# EAGLE design DenScript 5x5 Prototyping Board V1.0 (EAGLE 9.3.0)
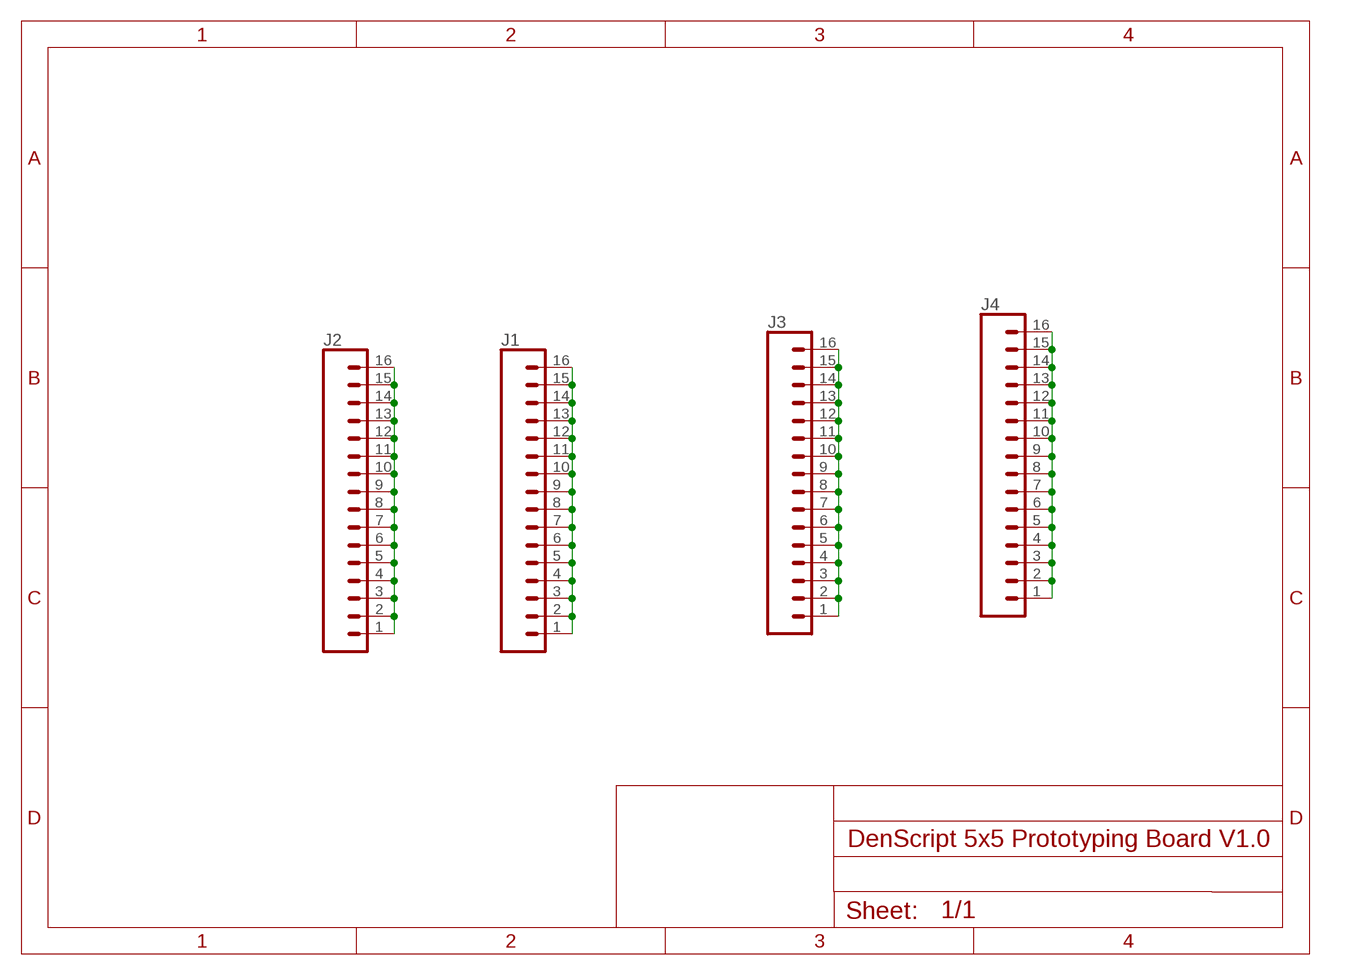
[diagram p0: schematic, sheet 1]

## Parts
J1  CONN_16  [1X16]
J2  CONN_16  [1X16]
J3  CONN_16  [1X16]
J4  CONN_16  [1X16]

## Nets
N$305: J2.1 J2.2 J2.3 J2.4 J2.5 J2.6 J2.7 J2.8 J2.9 J2.10 J2.11 J2.12 J2.13 J2.14 J2.15 J2.16
N$307: J3.1 J3.2 J3.3 J3.4 J3.5 J3.6 J3.7 J3.8 J3.9 J3.10 J3.11 J3.12 J3.13 J3.14 J3.15 J3.16
N$309: J1.1 J1.2 J1.3 J1.4 J1.5 J1.6 J1.7 J1.8 J1.9 J1.10 J1.11 J1.12 J1.13 J1.14 J1.15 J1.16
N$311: J4.1 J4.2 J4.3 J4.4 J4.5 J4.6 J4.7 J4.8 J4.9 J4.10 J4.11 J4.12 J4.13 J4.14 J4.15 J4.16

## Library data of the parts
J1-J4 = SparkFun-Connectors:CONN_16: Multi connection point. Often used as Generic Header-pin footprint for 0.1 inch spaced/style header connections On any of the 0.1 inch spaced packages, you can populate with these: Break Away Headers - Straight <https://www.sparkfun.com/products/116> (PRT-00116) Break Away Male Headers - Right Angle <https://www.sparkfun.com/products/553> (PRT-00553) Female Headers <https://www.sparkfun.com/products/115> (PRT-00115) Break Away Headers - Machine Pin <https://www.sparkfun.com/products/117> (PRT-00117) Break Away Female Headers - Swiss Machine Pin <https://www.sparkfun.com/products/743> (PRT-00743) For SCREWTERMINALS and SPRING TERMINALS visit here: Screw Terimnals on SparkFun.com <https://www.sparkfun.com/search/results?term=Screw+Terminals> (5mm/3.5mm/2.54mm spacing) This device is also useful as a general connection point to wire up your design to another part of your project. Our various solder wires solder well into these plated through hole pads. Hook-Up Wire - Assortment (Stranded, 22 AWG) <https://www.sparkfun.com/products/11375> (PRT-11375) Hook-Up Wire - Assortment (Solid Core, 22 AWG) <https://www.sparkfun.com/products/11367> (PRT-11367) View the entire wire category on our website here <https://www.sparkfun.com/categories/141> Special notes: Molex polarized connector foot print use with SKU : PRT-08231 with associated crimp pins and housings. 1MM SMD Version SKU: PRT-10208 NOTES ON THE VARIANTS LOCK and LOCK_LONGPADS... This footprint was designed to help hold the alignment of a through-hole component (i.e. 6-pin header) while soldering it into place. You may notice that each hole has been shifted either up or down by 0.005 of an inch from it's more standard position (which is a perfectly straight line). This slight alteration caused the pins (the squares in the middle) to touch the edges of the holes. Because they are alternating, it causes a "brace" to hold the component in place. 0.005 has proven to be the perfect amount of "off-center" position when using our standard breakaway headers. Although looks a little odd when you look at the bare footprint, once you have a header in there, the alteration is very hard to notice. Also,if you push a header all the way into place, it is covered up entirely on the bottom side.

## Board
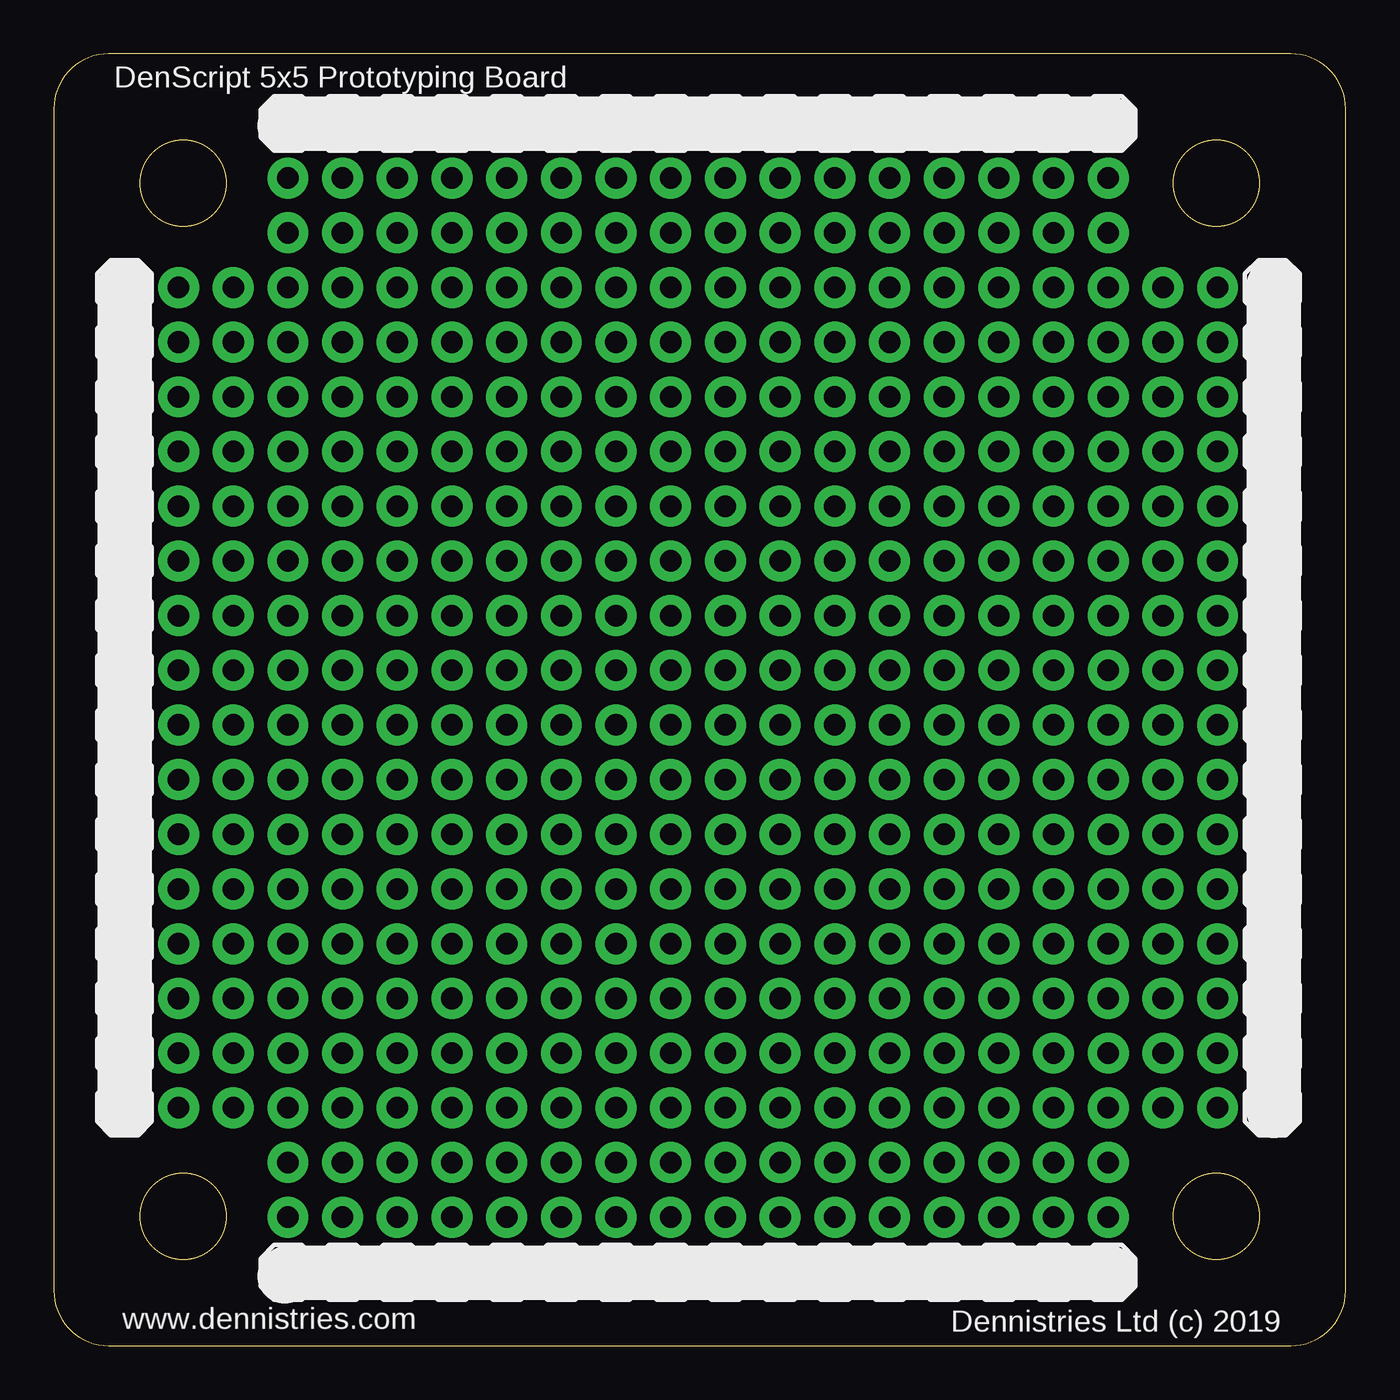
[diagram p1: board, top side]
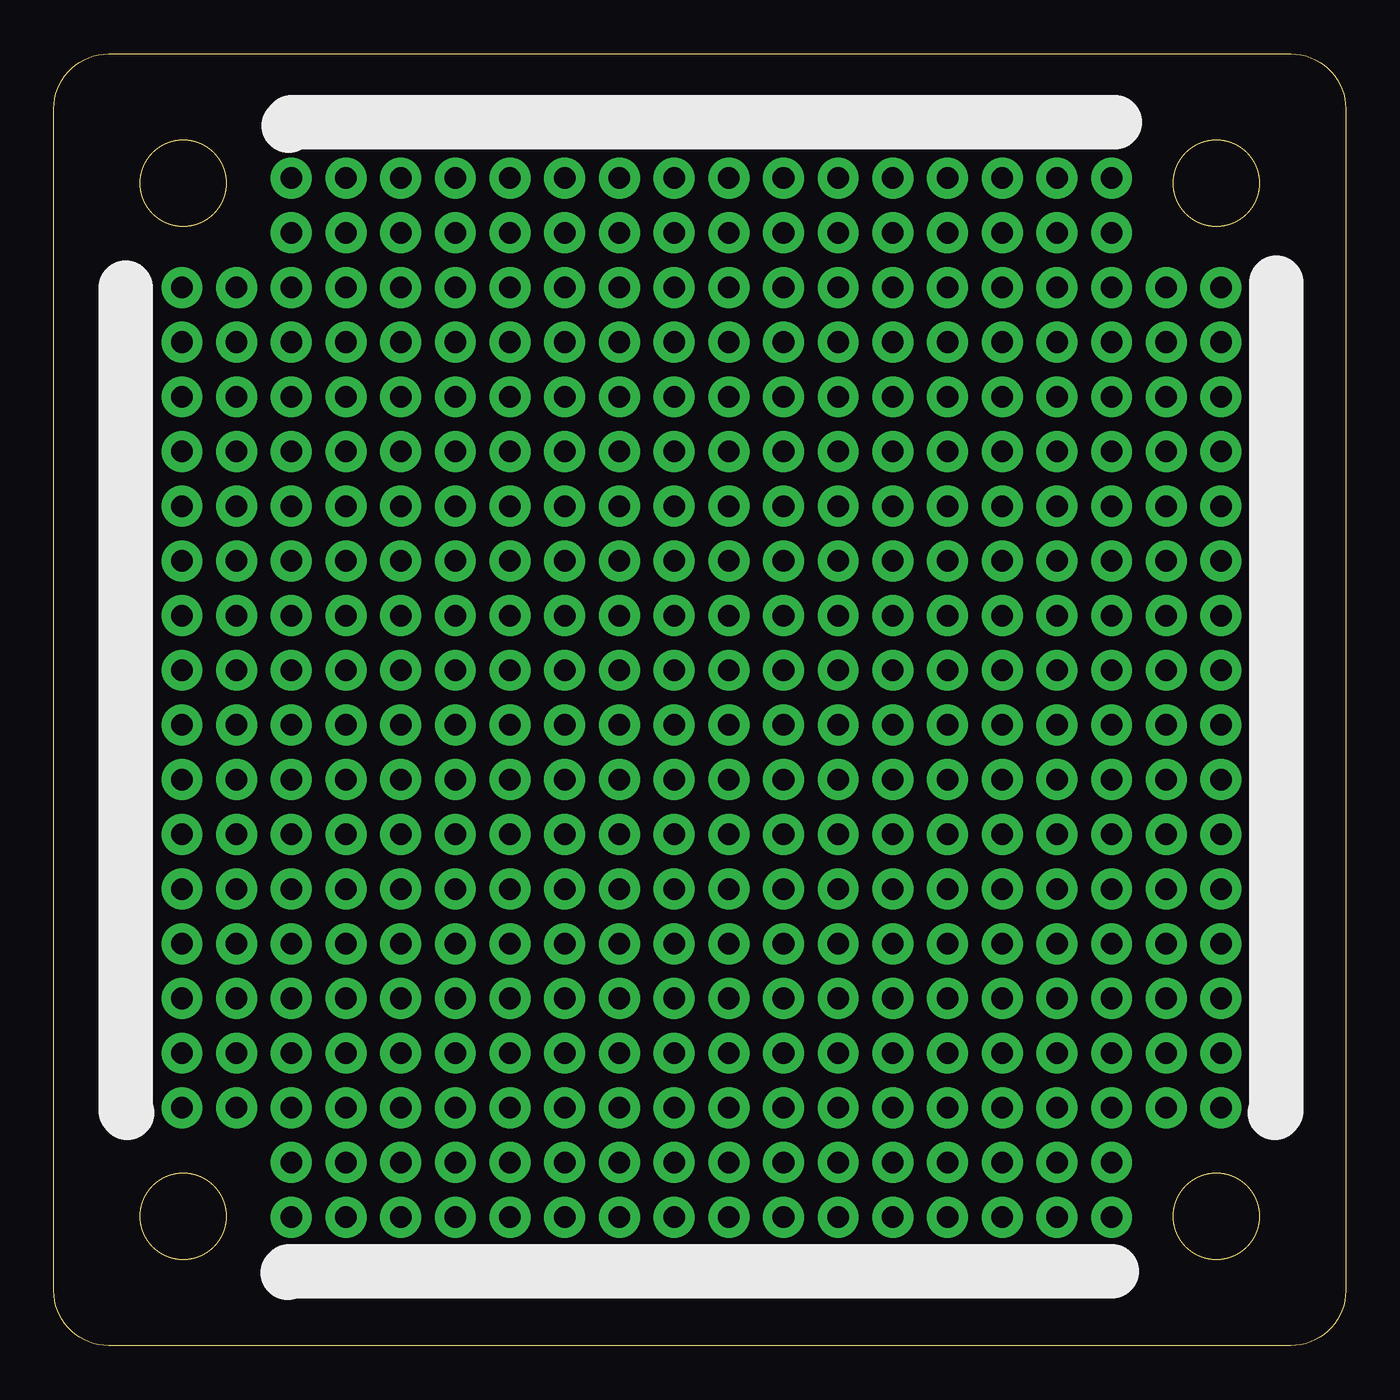
[diagram p2: board, bottom side, seen from below]

Size 60 x 60 mm. Coordinates in mm from the lower left corner, seen from the top.
Outline: 0,57.46 0,2.54 arc90 2.54,0 57.46,0 arc90 60,2.54 60,57.46 arc90 57.46,60 2.54,60 arc90 0,57.46
Outline: circle at 6,6 radius 2
Outline: circle at 6,54 radius 2
Outline: circle at 54,54 radius 2
Outline: circle at 54,6 radius 2
Copper layers (1*16): Top 0.035mm / dielectric 1.5mm / Bottom 0.035mm
Design rules "default": minimum track width 6mil, minimum drill 0.35mm, track to track 6mil, track to pad 6mil, pad to pad 6mil, via to via 6mil, smd to smd 6mil, copper to edge 40mil, drill to drill 6mil, minimum pad ring 10mil, minimum via ring 8mil, stop-mask expansion 4mil, vias tented up to drill 0mil, thermal gap 10mil

### Footprints (pad centres in the part's own frame; a part is rotated, then mirrored left to right if it is on the bottom)
1X16 = drill 1.016 pad 1.88: 1 0,0; 2 2.54,0; 3 5.08,0; 4 7.62,0; 5 10.16,0; 6 12.7,0; 7 15.24,0; 8 17.78,0; 9 20.32,0; 10 22.86,0; 11 25.4,0; 12 27.94,0; 13 30.48,0; 14 33.02,0; 15 35.56,0; 16 38.1,0

### Placement (x,y rotation side)
J1  10.87,3.4 0 top
J2  3.28,11.05 90 top
J3  56.59,11.05 90 top
J4  10.87,56.77 0 top

### Tracks (layer width: path | path; a pad name or v marks a point on that pad's centre or on a via)
N$1  (via drill 1 pad 1.9)
  other vias: 8.33,49.15
N$2  (via drill 1 pad 1.9)
  other vias: 10.87,49.15
N$3  (via drill 1 pad 1.9)
  other vias: 10.87,51.69
N$4  (via drill 1 pad 1.9)
  other vias: 13.41,51.69
N$5  (via drill 1 pad 1.9)
  other vias: 15.95,51.69
N$6  (via drill 1 pad 1.9)
  other vias: 18.49,51.69
N$7  (via drill 1 pad 1.9)
  other vias: 13.41,49.15
N$8  (via drill 1 pad 1.9)
  other vias: 15.95,49.15
N$9  (via drill 1 pad 1.9)
  other vias: 18.49,49.15
N$10  (via drill 1 pad 1.9)
  other vias: 21.03,51.69
N$11  (via drill 1 pad 1.9)
  other vias: 21.03,49.15
N$12  (via drill 1 pad 1.9)
  other vias: 23.57,49.15
N$13  (via drill 1 pad 1.9)
  other vias: 23.57,51.69
N$14  (via drill 1 pad 1.9)
  other vias: 26.11,51.69
N$15  (via drill 1 pad 1.9)
  other vias: 26.11,49.15
N$16  (via drill 1 pad 1.9)
  other vias: 28.65,49.15
N$17  (via drill 1 pad 1.9)
  other vias: 31.19,49.15
N$18  (via drill 1 pad 1.9)
  other vias: 33.73,49.15
N$19  (via drill 1 pad 1.9)
  other vias: 36.27,49.15
N$20  (via drill 1 pad 1.9)
  other vias: 38.81,49.15
N$21  (via drill 1 pad 1.9)
  other vias: 41.35,49.15
N$22  (via drill 1 pad 1.9)
  other vias: 43.89,49.15
N$23  (via drill 1 pad 1.9)
  other vias: 43.89,51.69
N$24  (via drill 1 pad 1.9)
  other vias: 41.35,51.69
N$25  (via drill 1 pad 1.9)
  other vias: 38.81,51.69
N$26  (via drill 1 pad 1.9)
  other vias: 36.27,51.69
N$27  (via drill 1 pad 1.9)
  other vias: 33.73,51.69
N$28  (via drill 1 pad 1.9)
  other vias: 31.19,51.69
N$29  (via drill 1 pad 1.9)
  other vias: 28.65,51.69
N$30  (via drill 1 pad 1.9)
  other vias: 46.43,49.15
N$31  (via drill 1 pad 1.9)
  other vias: 48.97,49.15
N$32  (via drill 1 pad 1.9)
  other vias: 48.97,51.69
N$33  (via drill 1 pad 1.9)
  other vias: 46.43,51.69
N$34  (via drill 1 pad 1.9)
  other vias: 51.51,49.15
N$35  (via drill 1 pad 1.9)
  other vias: 8.33,46.61
N$36  (via drill 1 pad 1.9)
  other vias: 10.87,46.61
N$37  (via drill 1 pad 1.9)
  other vias: 13.41,46.61
N$38  (via drill 1 pad 1.9)
  other vias: 15.95,46.61
N$39  (via drill 1 pad 1.9)
  other vias: 18.49,46.61
N$40  (via drill 1 pad 1.9)
  other vias: 21.03,46.61
N$41  (via drill 1 pad 1.9)
  other vias: 23.57,46.61
N$42  (via drill 1 pad 1.9)
  other vias: 26.11,46.61
N$43  (via drill 1 pad 1.9)
  other vias: 28.65,46.61
N$44  (via drill 1 pad 1.9)
  other vias: 31.19,46.61
N$45  (via drill 1 pad 1.9)
  other vias: 33.73,46.61
N$46  (via drill 1 pad 1.9)
  other vias: 36.27,46.61
N$47  (via drill 1 pad 1.9)
  other vias: 38.81,46.61
N$48  (via drill 1 pad 1.9)
  other vias: 41.35,46.61
N$49  (via drill 1 pad 1.9)
  other vias: 43.89,46.61
N$50  (via drill 1 pad 1.9)
  other vias: 46.43,46.61
N$51  (via drill 1 pad 1.9)
  other vias: 48.97,46.61
N$52  (via drill 1 pad 1.9)
  other vias: 51.51,46.61
N$53  (via drill 1 pad 1.9)
  other vias: 8.33,44.07
N$54  (via drill 1 pad 1.9)
  other vias: 10.87,44.07
N$55  (via drill 1 pad 1.9)
  other vias: 13.41,44.07
N$56  (via drill 1 pad 1.9)
  other vias: 15.95,44.07
N$57  (via drill 1 pad 1.9)
  other vias: 18.49,44.07
N$58  (via drill 1 pad 1.9)
  other vias: 21.03,44.07
N$59  (via drill 1 pad 1.9)
  other vias: 23.57,44.07
N$60  (via drill 1 pad 1.9)
  other vias: 26.11,44.07
N$61  (via drill 1 pad 1.9)
  other vias: 28.65,44.07
N$62  (via drill 1 pad 1.9)
  other vias: 31.19,44.07
N$63  (via drill 1 pad 1.9)
  other vias: 33.73,44.07
N$64  (via drill 1 pad 1.9)
  other vias: 36.27,44.07
N$65  (via drill 1 pad 1.9)
  other vias: 38.81,44.07
N$66  (via drill 1 pad 1.9)
  other vias: 41.35,44.07
N$67  (via drill 1 pad 1.9)
  other vias: 43.89,44.07
N$68  (via drill 1 pad 1.9)
  other vias: 46.43,44.07
N$69  (via drill 1 pad 1.9)
  other vias: 48.97,44.07
N$70  (via drill 1 pad 1.9)
  other vias: 51.51,44.07
N$71  (via drill 1 pad 1.9)
  other vias: 8.33,41.53
N$72  (via drill 1 pad 1.9)
  other vias: 10.87,41.53
N$73  (via drill 1 pad 1.9)
  other vias: 13.41,41.53
N$74  (via drill 1 pad 1.9)
  other vias: 15.95,41.53
N$75  (via drill 1 pad 1.9)
  other vias: 18.49,41.53
N$76  (via drill 1 pad 1.9)
  other vias: 21.03,41.53
N$77  (via drill 1 pad 1.9)
  other vias: 23.57,41.53
N$78  (via drill 1 pad 1.9)
  other vias: 26.11,41.53
N$79  (via drill 1 pad 1.9)
  other vias: 28.65,41.53
N$80  (via drill 1 pad 1.9)
  other vias: 31.19,41.53
N$81  (via drill 1 pad 1.9)
  other vias: 33.73,41.53
N$82  (via drill 1 pad 1.9)
  other vias: 36.27,41.53
N$83  (via drill 1 pad 1.9)
  other vias: 38.81,41.53
N$84  (via drill 1 pad 1.9)
  other vias: 41.35,41.53
N$85  (via drill 1 pad 1.9)
  other vias: 43.89,41.53
N$86  (via drill 1 pad 1.9)
  other vias: 46.43,41.53
N$87  (via drill 1 pad 1.9)
  other vias: 48.97,41.53
N$88  (via drill 1 pad 1.9)
  other vias: 51.51,41.53
N$89  (via drill 1 pad 1.9)
  other vias: 8.33,38.99
N$90  (via drill 1 pad 1.9)
  other vias: 10.87,38.99
N$91  (via drill 1 pad 1.9)
  other vias: 13.41,38.99
N$92  (via drill 1 pad 1.9)
  other vias: 15.95,38.99
N$93  (via drill 1 pad 1.9)
  other vias: 18.49,38.99
N$94  (via drill 1 pad 1.9)
  other vias: 21.03,38.99
N$95  (via drill 1 pad 1.9)
  other vias: 23.57,38.99
N$96  (via drill 1 pad 1.9)
  other vias: 26.11,38.99
N$97  (via drill 1 pad 1.9)
  other vias: 28.65,38.99
N$98  (via drill 1 pad 1.9)
  other vias: 31.19,38.99
N$99  (via drill 1 pad 1.9)
  other vias: 33.73,38.99
N$100  (via drill 1 pad 1.9)
  other vias: 36.27,38.99
N$101  (via drill 1 pad 1.9)
  other vias: 38.81,38.99
N$102  (via drill 1 pad 1.9)
  other vias: 41.35,38.99
N$103  (via drill 1 pad 1.9)
  other vias: 43.89,38.99
N$104  (via drill 1 pad 1.9)
  other vias: 46.43,38.99
N$105  (via drill 1 pad 1.9)
  other vias: 48.97,38.99
N$106  (via drill 1 pad 1.9)
  other vias: 51.51,38.99
N$107  (via drill 1 pad 1.9)
  other vias: 8.33,36.45
N$108  (via drill 1 pad 1.9)
  other vias: 10.87,36.45
N$109  (via drill 1 pad 1.9)
  other vias: 13.41,36.45
N$110  (via drill 1 pad 1.9)
  other vias: 15.95,36.45
N$111  (via drill 1 pad 1.9)
  other vias: 18.49,36.45
N$112  (via drill 1 pad 1.9)
  other vias: 21.03,36.45
N$113  (via drill 1 pad 1.9)
  other vias: 23.57,36.45
N$114  (via drill 1 pad 1.9)
  other vias: 26.11,36.45
N$115  (via drill 1 pad 1.9)
  other vias: 28.65,36.45
N$116  (via drill 1 pad 1.9)
  other vias: 31.19,36.45
N$117  (via drill 1 pad 1.9)
  other vias: 33.73,36.45
N$118  (via drill 1 pad 1.9)
  other vias: 36.27,36.45
N$119  (via drill 1 pad 1.9)
  other vias: 38.81,36.45
N$120  (via drill 1 pad 1.9)
  other vias: 41.35,36.45
N$121  (via drill 1 pad 1.9)
  other vias: 43.89,36.45
N$122  (via drill 1 pad 1.9)
  other vias: 46.43,36.45
N$123  (via drill 1 pad 1.9)
  other vias: 48.97,36.45
N$124  (via drill 1 pad 1.9)
  other vias: 51.51,36.45
N$125  (via drill 1 pad 1.9)
  other vias: 8.33,33.91
N$126  (via drill 1 pad 1.9)
  other vias: 10.87,33.91
N$127  (via drill 1 pad 1.9)
  other vias: 13.41,33.91
N$128  (via drill 1 pad 1.9)
  other vias: 15.95,33.91
N$129  (via drill 1 pad 1.9)
  other vias: 18.49,33.91
N$130  (via drill 1 pad 1.9)
  other vias: 21.03,33.91
N$131  (via drill 1 pad 1.9)
  other vias: 23.57,33.91
N$132  (via drill 1 pad 1.9)
  other vias: 26.11,33.91
N$133  (via drill 1 pad 1.9)
  other vias: 28.65,33.91
N$134  (via drill 1 pad 1.9)
  other vias: 31.19,33.91
N$135  (via drill 1 pad 1.9)
  other vias: 33.73,33.91
N$136  (via drill 1 pad 1.9)
  other vias: 36.27,33.91
N$137  (via drill 1 pad 1.9)
  other vias: 38.81,33.91
N$138  (via drill 1 pad 1.9)
  other vias: 41.35,33.91
N$139  (via drill 1 pad 1.9)
  other vias: 43.89,33.91
N$140  (via drill 1 pad 1.9)
  other vias: 46.43,33.91
N$141  (via drill 1 pad 1.9)
  other vias: 48.97,33.91
N$142  (via drill 1 pad 1.9)
  other vias: 51.51,33.91
N$143  (via drill 1 pad 1.9)
  other vias: 8.33,31.37
N$144  (via drill 1 pad 1.9)
  other vias: 10.87,31.37
N$145  (via drill 1 pad 1.9)
  other vias: 13.41,31.37
N$146  (via drill 1 pad 1.9)
  other vias: 15.95,31.37
N$147  (via drill 1 pad 1.9)
  other vias: 18.49,31.37
N$148  (via drill 1 pad 1.9)
  other vias: 21.03,31.37
N$149  (via drill 1 pad 1.9)
  other vias: 23.57,31.37
N$150  (via drill 1 pad 1.9)
  other vias: 26.11,31.37
N$151  (via drill 1 pad 1.9)
  other vias: 28.65,31.37
N$152  (via drill 1 pad 1.9)
  other vias: 31.19,31.37
N$153  (via drill 1 pad 1.9)
  other vias: 33.73,31.37
N$154  (via drill 1 pad 1.9)
  other vias: 36.27,31.37
N$155  (via drill 1 pad 1.9)
  other vias: 38.81,31.37
N$156  (via drill 1 pad 1.9)
  other vias: 41.35,31.37
N$157  (via drill 1 pad 1.9)
  other vias: 43.89,31.37
N$158  (via drill 1 pad 1.9)
  other vias: 46.43,31.37
N$159  (via drill 1 pad 1.9)
  other vias: 48.97,31.37
N$160  (via drill 1 pad 1.9)
  other vias: 51.51,31.37
N$161  (via drill 1 pad 1.9)
  other vias: 8.33,28.83
N$162  (via drill 1 pad 1.9)
  other vias: 10.87,28.83
N$163  (via drill 1 pad 1.9)
  other vias: 13.41,28.83
N$164  (via drill 1 pad 1.9)
  other vias: 15.95,28.83
N$165  (via drill 1 pad 1.9)
  other vias: 18.49,28.83
N$166  (via drill 1 pad 1.9)
  other vias: 21.03,28.83
N$167  (via drill 1 pad 1.9)
  other vias: 23.57,28.83
N$168  (via drill 1 pad 1.9)
  other vias: 26.11,28.83
N$169  (via drill 1 pad 1.9)
  other vias: 28.65,28.83
N$170  (via drill 1 pad 1.9)
  other vias: 31.19,28.83
N$171  (via drill 1 pad 1.9)
  other vias: 33.73,28.83
N$172  (via drill 1 pad 1.9)
  other vias: 36.27,28.83
N$173  (via drill 1 pad 1.9)
  other vias: 38.81,28.83
N$174  (via drill 1 pad 1.9)
  other vias: 41.35,28.83
N$175  (via drill 1 pad 1.9)
  other vias: 43.89,28.83
N$176  (via drill 1 pad 1.9)
  other vias: 46.43,28.83
N$177  (via drill 1 pad 1.9)
  other vias: 48.97,28.83
N$178  (via drill 1 pad 1.9)
  other vias: 51.51,28.83
N$179  (via drill 1 pad 1.9)
  other vias: 8.33,26.29
N$180  (via drill 1 pad 1.9)
  other vias: 10.87,26.29
N$181  (via drill 1 pad 1.9)
  other vias: 13.41,26.29
N$182  (via drill 1 pad 1.9)
  other vias: 15.95,26.29
N$183  (via drill 1 pad 1.9)
  other vias: 18.49,26.29
N$184  (via drill 1 pad 1.9)
  other vias: 21.03,26.29
N$185  (via drill 1 pad 1.9)
  other vias: 23.57,26.29
N$186  (via drill 1 pad 1.9)
  other vias: 26.11,26.29
N$187  (via drill 1 pad 1.9)
  other vias: 28.65,26.29
N$188  (via drill 1 pad 1.9)
  other vias: 31.19,26.29
N$189  (via drill 1 pad 1.9)
  other vias: 33.73,26.29
N$190  (via drill 1 pad 1.9)
  other vias: 36.27,26.29
N$191  (via drill 1 pad 1.9)
  other vias: 38.81,26.29
N$192  (via drill 1 pad 1.9)
  other vias: 41.35,26.29
N$193  (via drill 1 pad 1.9)
  other vias: 43.89,26.29
N$194  (via drill 1 pad 1.9)
  other vias: 46.43,26.29
N$195  (via drill 1 pad 1.9)
  other vias: 48.97,26.29
N$196  (via drill 1 pad 1.9)
  other vias: 51.51,26.29
N$197  (via drill 1 pad 1.9)
  other vias: 8.33,23.75
N$198  (via drill 1 pad 1.9)
  other vias: 10.87,23.75
N$199  (via drill 1 pad 1.9)
  other vias: 13.41,23.75
N$200  (via drill 1 pad 1.9)
  other vias: 15.95,23.75
N$201  (via drill 1 pad 1.9)
  other vias: 18.49,23.75
N$202  (via drill 1 pad 1.9)
  other vias: 21.03,23.75
N$203  (via drill 1 pad 1.9)
  other vias: 23.57,23.75
N$204  (via drill 1 pad 1.9)
  other vias: 26.11,23.75
N$205  (via drill 1 pad 1.9)
  other vias: 28.65,23.75
N$206  (via drill 1 pad 1.9)
  other vias: 31.19,23.75
N$207  (via drill 1 pad 1.9)
  other vias: 33.73,23.75
N$208  (via drill 1 pad 1.9)
  other vias: 36.27,23.75
N$209  (via drill 1 pad 1.9)
  other vias: 38.81,23.75
N$210  (via drill 1 pad 1.9)
  other vias: 41.35,23.75
N$211  (via drill 1 pad 1.9)
  other vias: 43.89,23.75
N$212  (via drill 1 pad 1.9)
  other vias: 46.43,23.75
N$213  (via drill 1 pad 1.9)
  other vias: 48.97,23.75
N$214  (via drill 1 pad 1.9)
  other vias: 51.51,23.75
N$215  (via drill 1 pad 1.9)
  other vias: 8.33,21.21
N$216  (via drill 1 pad 1.9)
  other vias: 10.87,21.21
N$217  (via drill 1 pad 1.9)
  other vias: 13.41,21.21
N$218  (via drill 1 pad 1.9)
  other vias: 15.95,21.21
N$219  (via drill 1 pad 1.9)
  other vias: 18.49,21.21
N$220  (via drill 1 pad 1.9)
  other vias: 21.03,21.21
N$221  (via drill 1 pad 1.9)
  other vias: 23.57,21.21
N$222  (via drill 1 pad 1.9)
  other vias: 26.11,21.21
N$223  (via drill 1 pad 1.9)
  other vias: 28.65,21.21
N$224  (via drill 1 pad 1.9)
  other vias: 31.19,21.21
N$225  (via drill 1 pad 1.9)
  other vias: 33.73,21.21
N$226  (via drill 1 pad 1.9)
  other vias: 36.27,21.21
N$227  (via drill 1 pad 1.9)
  other vias: 38.81,21.21
N$228  (via drill 1 pad 1.9)
  other vias: 41.35,21.21
N$229  (via drill 1 pad 1.9)
  other vias: 43.89,21.21
N$230  (via drill 1 pad 1.9)
  other vias: 46.43,21.21
N$231  (via drill 1 pad 1.9)
  other vias: 48.97,21.21
N$232  (via drill 1 pad 1.9)
  other vias: 51.51,21.21
N$233  (via drill 1 pad 1.9)
  other vias: 8.33,18.67
N$234  (via drill 1 pad 1.9)
  other vias: 10.87,18.67
N$235  (via drill 1 pad 1.9)
  other vias: 13.41,18.67
N$236  (via drill 1 pad 1.9)
  other vias: 15.95,18.67
N$237  (via drill 1 pad 1.9)
  other vias: 18.49,18.67
N$238  (via drill 1 pad 1.9)
  other vias: 21.03,18.67
N$239  (via drill 1 pad 1.9)
  other vias: 23.57,18.67
N$240  (via drill 1 pad 1.9)
  other vias: 26.11,18.67
N$241  (via drill 1 pad 1.9)
  other vias: 28.65,18.67
N$242  (via drill 1 pad 1.9)
  other vias: 31.19,18.67
N$243  (via drill 1 pad 1.9)
  other vias: 33.73,18.67
N$244  (via drill 1 pad 1.9)
  other vias: 36.27,18.67
N$245  (via drill 1 pad 1.9)
  other vias: 38.81,18.67
N$246  (via drill 1 pad 1.9)
  other vias: 41.35,18.67
N$247  (via drill 1 pad 1.9)
  other vias: 43.89,18.67
N$248  (via drill 1 pad 1.9)
  other vias: 46.43,18.67
N$249  (via drill 1 pad 1.9)
  other vias: 48.97,18.67
N$250  (via drill 1 pad 1.9)
  other vias: 51.51,18.67
N$251  (via drill 1 pad 1.9)
  other vias: 8.33,16.13
N$252  (via drill 1 pad 1.9)
  other vias: 10.87,16.13
N$253  (via drill 1 pad 1.9)
  other vias: 13.41,16.13
N$254  (via drill 1 pad 1.9)
  other vias: 15.95,16.13
N$255  (via drill 1 pad 1.9)
  other vias: 18.49,16.13
N$256  (via drill 1 pad 1.9)
  other vias: 21.03,16.13
N$257  (via drill 1 pad 1.9)
  other vias: 23.57,16.13
N$258  (via drill 1 pad 1.9)
  other vias: 26.11,16.13
N$259  (via drill 1 pad 1.9)
  other vias: 28.65,16.13
N$260  (via drill 1 pad 1.9)
  other vias: 31.19,16.13
N$261  (via drill 1 pad 1.9)
  other vias: 33.73,16.13
N$262  (via drill 1 pad 1.9)
  other vias: 36.27,16.13
N$263  (via drill 1 pad 1.9)
  other vias: 38.81,16.13
N$264  (via drill 1 pad 1.9)
  other vias: 41.35,16.13
N$265  (via drill 1 pad 1.9)
  other vias: 43.89,16.13
N$266  (via drill 1 pad 1.9)
  other vias: 46.43,16.13
N$267  (via drill 1 pad 1.9)
  other vias: 48.97,16.13
N$268  (via drill 1 pad 1.9)
  other vias: 51.51,16.13
N$269  (via drill 1 pad 1.9)
  other vias: 8.33,13.59
N$270  (via drill 1 pad 1.9)
  other vias: 10.87,13.59
N$271  (via drill 1 pad 1.9)
  other vias: 13.41,13.59
N$272  (via drill 1 pad 1.9)
  other vias: 15.95,13.59
N$273  (via drill 1 pad 1.9)
  other vias: 18.49,13.59
N$274  (via drill 1 pad 1.9)
  other vias: 21.03,13.59
N$275  (via drill 1 pad 1.9)
  other vias: 23.57,13.59
N$276  (via drill 1 pad 1.9)
  other vias: 26.11,13.59
N$277  (via drill 1 pad 1.9)
  other vias: 28.65,13.59
N$278  (via drill 1 pad 1.9)
  other vias: 31.19,13.59
N$279  (via drill 1 pad 1.9)
  other vias: 33.73,13.59
N$280  (via drill 1 pad 1.9)
  other vias: 36.27,13.59
N$281  (via drill 1 pad 1.9)
  other vias: 38.81,13.59
N$282  (via drill 1 pad 1.9)
  other vias: 41.35,13.59
N$283  (via drill 1 pad 1.9)
  other vias: 43.89,13.59
N$284  (via drill 1 pad 1.9)
  other vias: 46.43,13.59
N$285  (via drill 1 pad 1.9)
  other vias: 48.97,13.59
N$286  (via drill 1 pad 1.9)
  other vias: 51.51,13.59
N$287  (via drill 1 pad 1.9)
  other vias: 8.33,11.05
N$288  (via drill 1 pad 1.9)
  other vias: 10.87,11.05
N$289  (via drill 1 pad 1.9)
  other vias: 13.41,11.05
N$290  (via drill 1 pad 1.9)
  other vias: 15.95,11.05
N$291  (via drill 1 pad 1.9)
  other vias: 18.49,11.05
N$292  (via drill 1 pad 1.9)
  other vias: 21.03,11.05
N$293  (via drill 1 pad 1.9)
  other vias: 23.57,11.05
N$294  (via drill 1 pad 1.9)
  other vias: 26.11,11.05
N$295  (via drill 1 pad 1.9)
  other vias: 28.65,11.05
N$296  (via drill 1 pad 1.9)
  other vias: 31.19,11.05
N$297  (via drill 1 pad 1.9)
  other vias: 33.73,11.05
N$298  (via drill 1 pad 1.9)
  other vias: 36.27,11.05
N$299  (via drill 1 pad 1.9)
  other vias: 38.81,11.05
N$300  (via drill 1 pad 1.9)
  other vias: 41.35,11.05
N$301  (via drill 1 pad 1.9)
  other vias: 43.89,11.05
N$302  (via drill 1 pad 1.9)
  other vias: 46.43,11.05
N$303  (via drill 1 pad 1.9)
  other vias: 48.97,11.05
N$304  (via drill 1 pad 1.9)
  other vias: 51.51,11.05
N$305
  Top 0.152: J2.5 3.35,21.18 3.28,21.18 | 3.28,31.39 3.35,31.39 J2.9 | 3.28,32.31 3.35,32.31 3.28,33.02 | J2.8 3.35,28.8 3.28,28.8
  Top 1.524: J2.16 J2.15 J2.14 J2.13 J2.12 J2.11 J2.10 3.28,33.02 3.28,32.31 3.28,31.39 J2.9 | J2.9 J2.8 3.28,28.8 3.28,27.94 J2.7 J2.6 J2.5 3.28,21.18 3.28,20.32 J2.4 J2.3 J2.1 J2.2 | J2.9 3.28,30.48
N$306  (via drill 1 pad 1.9)
  other vias: 5.79,49.15
N$307
  Top 0.152: J3.2 56.69,13.56 56.59,13.56 | 56.59,31.24 56.69,31.24 J3.9 | J3.3 56.69,16.15 56.59,16.15 | J3.4 56.69,18.75 56.59,18.75 | J3.5 56.69,21.18 56.59,21.18 | J3.6 56.69,23.77 56.59,23.77 | J3.7 56.69,26.36 56.59,26.36 | J3.8 56.69,28.8 56.59,28.8 | J3.10 56.69,33.98 56.59,33.98 | J3.11 56.69,36.42 56.59,36.42 | J3.12 56.69,39.01 56.59,39.01 | J3.13 56.69,41.6 56.59,41.6 | J3.14 56.69,44.04 56.59,44.04 | J3.15 56.69,46.63 56.59,46.63
  Top 1.524: J3.16 56.59,46.63 J3.15 J3.14 56.59,44.04 56.59,41.6 J3.13 56.59,39.01 J3.12 J3.11 56.59,36.42 56.59,33.98 J3.10 J3.9 56.59,31.24 J3.8 56.59,28.8 56.59,26.36 J3.7 56.59,23.77 J3.6 J3.5 56.59,21.18 56.59,18.75 J3.4 56.59,16.15 J3.3 J3.2 56.59,13.56 J3.1
N$308  (via drill 1 pad 1.9)
  other vias: 5.79,46.61
N$309
  Top 0.152: 13.41,3.35 J1.2 | 31.09,3.4 31.09,3.35 J1.9 | J1.3 16,3.35 16,3.4 | J1.4 18.59,3.35 18.59,3.4 | 21.03,3.35 J1.5 | J1.6 23.62,3.35 23.62,3.4 | J1.7 26.21,3.35 26.21,3.4 | 28.65,3.35 J1.8 | J1.10 33.83,3.35 33.83,3.4 | 36.27,3.35 J1.11 | J1.12 38.86,3.35 38.86,3.4 | J1.13 41.45,3.35 41.45,3.4 | 43.89,3.35 J1.14 | J1.15 46.48,3.35 46.48,3.4
  Top 1.524: J1.1 J1.2 J1.3 16,3.4 J1.4 18.59,3.4 J1.5 J1.6 23.62,3.4 J1.7 26.21,3.4 J1.8 31.09,3.4 J1.9 J1.10 33.83,3.4 J1.11 J1.12 38.86,3.4 J1.13 41.45,3.4 J1.14 J1.15 46.48,3.4 J1.16
N$310  (via drill 1 pad 1.9)
  other vias: 5.79,44.07
N$311
  Top 0.152: 13.41,56.84 J4.2 | 31.09,56.77 31.09,56.84 J4.9 | J4.3 16,56.84 16,56.77 | J4.4 18.59,56.84 18.59,56.77 | 21.03,56.84 J4.5 | J4.6 23.62,56.84 23.62,56.77 | J4.7 26.21,56.84 26.21,56.77 | 28.65,56.84 J4.8 | J4.10 33.83,56.84 33.83,56.77 | 36.27,56.84 J4.11 | J4.12 38.86,56.84 38.86,56.77 | J4.13 41.45,56.84 41.45,56.77 | 43.89,56.84 J4.14 | J4.15 46.48,56.84 46.48,56.77
  Top 1.524: J4.1 J4.2 J4.3 16,56.77 J4.4 18.59,56.77 J4.5 J4.6 23.62,56.77 J4.7 26.21,56.77 J4.8 31.09,56.77 J4.9 J4.10 33.83,56.77 J4.11 J4.12 38.86,56.77 J4.13 41.45,56.77 J4.14 J4.15 46.48,56.77 J4.16
N$312  (via drill 1 pad 1.9)
  other vias: 5.79,41.53
N$314  (via drill 1 pad 1.9)
  other vias: 5.79,38.99
N$316  (via drill 1 pad 1.9)
  other vias: 5.79,36.45
N$318  (via drill 1 pad 1.9)
  other vias: 5.79,33.91
N$320  (via drill 1 pad 1.9)
  other vias: 5.79,31.37
N$322  (via drill 1 pad 1.9)
  other vias: 5.79,28.83
N$324  (via drill 1 pad 1.9)
  other vias: 5.79,26.29
N$326  (via drill 1 pad 1.9)
  other vias: 5.79,23.75
N$328  (via drill 1 pad 1.9)
  other vias: 5.79,21.21
N$330  (via drill 1 pad 1.9)
  other vias: 5.79,18.67
N$332  (via drill 1 pad 1.9)
  other vias: 5.79,16.13
N$334  (via drill 1 pad 1.9)
  other vias: 5.79,13.59
N$336  (via drill 1 pad 1.9)
  other vias: 5.79,11.05
N$337  (via drill 1 pad 1.9)
  other vias: 54.05,49.15
N$339  (via drill 1 pad 1.9)
  other vias: 54.05,46.61
N$341  (via drill 1 pad 1.9)
  other vias: 54.05,44.07
N$343  (via drill 1 pad 1.9)
  other vias: 54.05,41.53
N$345  (via drill 1 pad 1.9)
  other vias: 54.05,38.99
N$347  (via drill 1 pad 1.9)
  other vias: 54.05,36.45
N$349  (via drill 1 pad 1.9)
  other vias: 54.05,33.91
N$351  (via drill 1 pad 1.9)
  other vias: 54.05,31.37
N$353  (via drill 1 pad 1.9)
  other vias: 54.05,28.83
N$355  (via drill 1 pad 1.9)
  other vias: 54.05,26.29
N$357  (via drill 1 pad 1.9)
  other vias: 54.05,23.75
N$359  (via drill 1 pad 1.9)
  other vias: 54.05,21.21
N$361  (via drill 1 pad 1.9)
  other vias: 54.05,18.67
N$363  (via drill 1 pad 1.9)
  other vias: 54.05,16.13
N$365  (via drill 1 pad 1.9)
  other vias: 54.05,13.59
N$367  (via drill 1 pad 1.9)
  other vias: 54.05,11.05
N$369  (via drill 1 pad 1.9)
  other vias: 10.87,8.51
N$370  (via drill 1 pad 1.9)
  other vias: 13.41,8.51
N$371  (via drill 1 pad 1.9)
  other vias: 15.95,8.51
N$372  (via drill 1 pad 1.9)
  other vias: 18.49,8.51
N$373  (via drill 1 pad 1.9)
  other vias: 21.03,8.51
N$374  (via drill 1 pad 1.9)
  other vias: 23.57,8.51
N$375  (via drill 1 pad 1.9)
  other vias: 26.11,8.51
N$376  (via drill 1 pad 1.9)
  other vias: 28.65,8.51
N$377  (via drill 1 pad 1.9)
  other vias: 31.19,8.51
N$378  (via drill 1 pad 1.9)
  other vias: 33.73,8.51
N$379  (via drill 1 pad 1.9)
  other vias: 36.27,8.51
N$380  (via drill 1 pad 1.9)
  other vias: 38.81,8.51
N$381  (via drill 1 pad 1.9)
  other vias: 41.35,8.51
N$382  (via drill 1 pad 1.9)
  other vias: 43.89,8.51
N$383  (via drill 1 pad 1.9)
  other vias: 46.43,8.51
N$384  (via drill 1 pad 1.9)
  other vias: 48.97,8.51
N$385  (via drill 1 pad 1.9)
  other vias: 10.87,5.97
N$386  (via drill 1 pad 1.9)
  other vias: 13.41,5.97
N$387  (via drill 1 pad 1.9)
  other vias: 15.95,5.97
N$388  (via drill 1 pad 1.9)
  other vias: 18.49,5.97
N$389  (via drill 1 pad 1.9)
  other vias: 21.03,5.97
N$390  (via drill 1 pad 1.9)
  other vias: 23.57,5.97
N$391  (via drill 1 pad 1.9)
  other vias: 26.11,5.97
N$392  (via drill 1 pad 1.9)
  other vias: 28.65,5.97
N$393  (via drill 1 pad 1.9)
  other vias: 31.19,5.97
N$394  (via drill 1 pad 1.9)
  other vias: 33.73,5.97
N$395  (via drill 1 pad 1.9)
  other vias: 36.27,5.97
N$396  (via drill 1 pad 1.9)
  other vias: 38.81,5.97
N$397  (via drill 1 pad 1.9)
  other vias: 41.35,5.97
N$398  (via drill 1 pad 1.9)
  other vias: 43.89,5.97
N$399  (via drill 1 pad 1.9)
  other vias: 46.43,5.97
N$400  (via drill 1 pad 1.9)
  other vias: 48.97,5.97
N$417  (via drill 1 pad 1.9)
  other vias: 10.87,54.23
N$418  (via drill 1 pad 1.9)
  other vias: 13.41,54.23
N$419  (via drill 1 pad 1.9)
  other vias: 15.95,54.23
N$420  (via drill 1 pad 1.9)
  other vias: 18.49,54.23
N$421  (via drill 1 pad 1.9)
  other vias: 21.03,54.23
N$422  (via drill 1 pad 1.9)
  other vias: 23.57,54.23
N$423  (via drill 1 pad 1.9)
  other vias: 26.11,54.23
N$424  (via drill 1 pad 1.9)
  other vias: 28.65,54.23
N$425  (via drill 1 pad 1.9)
  other vias: 31.19,54.23
N$426  (via drill 1 pad 1.9)
  other vias: 33.73,54.23
N$427  (via drill 1 pad 1.9)
  other vias: 36.27,54.23
N$428  (via drill 1 pad 1.9)
  other vias: 38.81,54.23
N$429  (via drill 1 pad 1.9)
  other vias: 41.35,54.23
N$430  (via drill 1 pad 1.9)
  other vias: 43.89,54.23
N$431  (via drill 1 pad 1.9)
  other vias: 46.43,54.23
N$432  (via drill 1 pad 1.9)
  other vias: 48.97,54.23

### Text on the board
tPlace: DenScript 5x5 Prototyping Board | www.dennistries.com | Dennistries Ltd (c) 2019